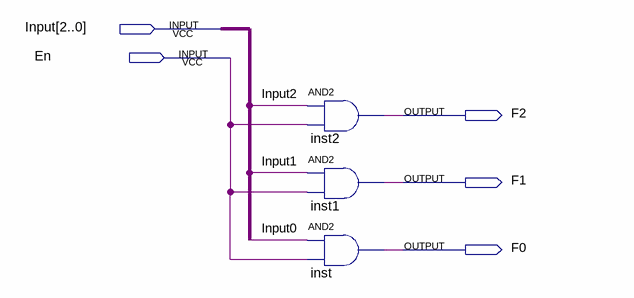
[diagram p0: schematic sheet]
// Quartus schematic bus_output.bdf as structural Verilog: 3 symbols, 5 pins
module bus_output (
  input  [2:0] Input,
  input  En,
  output F2,
  output F1,
  output F0
);

  and inst2 (F2, Input[2], En);
  and inst1 (F1, Input[1], En);
  and inst (F0, Input[0], En);
endmodule
